# Altium schematic sheet Umb104.SchDoc
size A
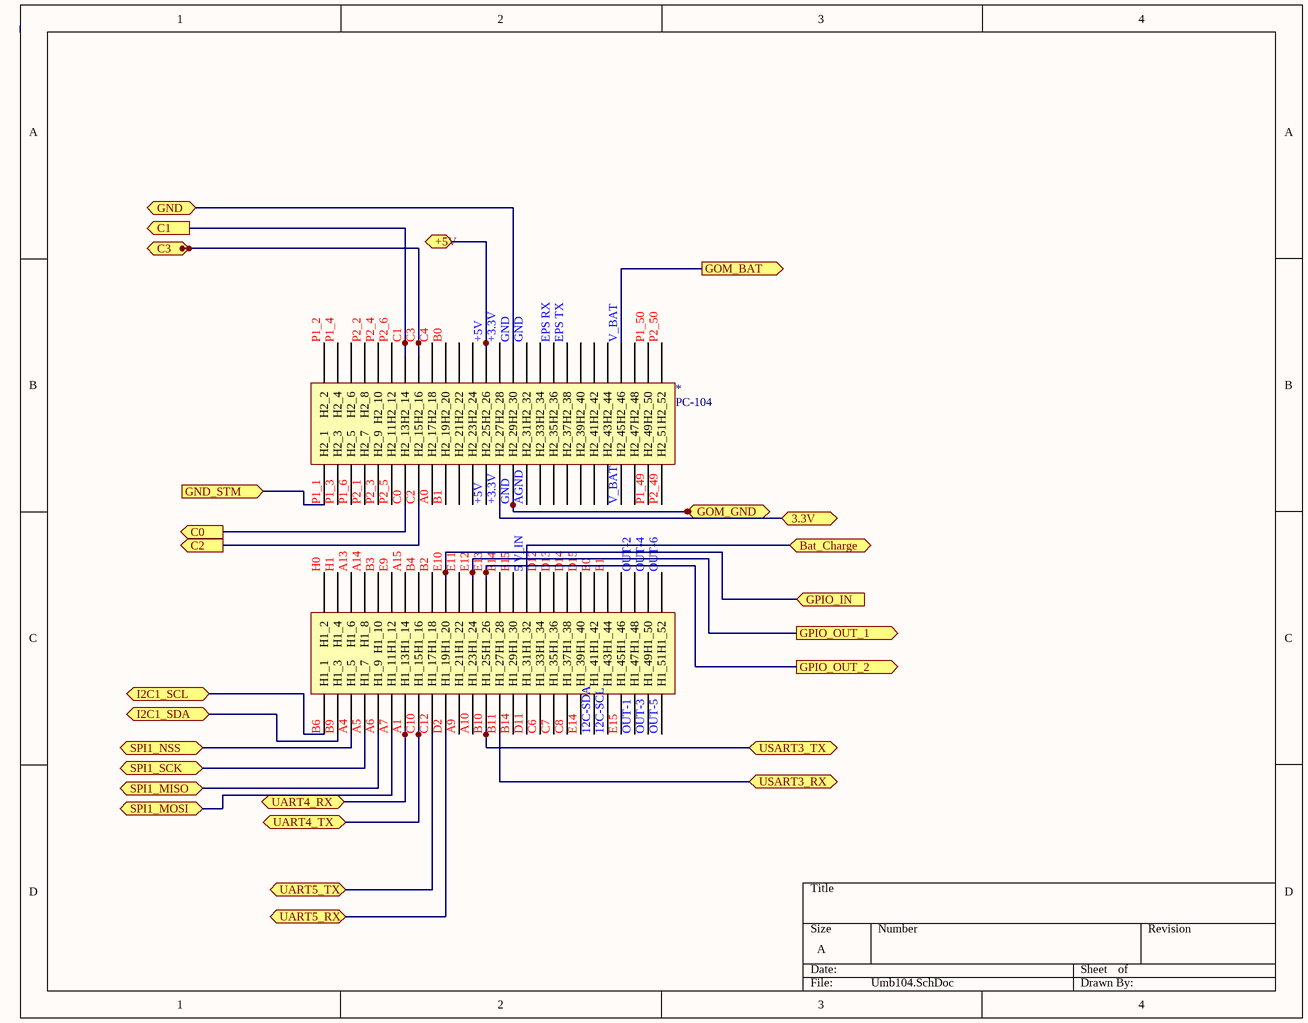
[diagram p0: Umb104.SchDoc]

## Parts
*  PC-104  [PC-104FOOTPRINT]

## Ports
3.3V (bidir), +5V (bidir), Bat_Charge (bidir), C0 (out), C1 (out), C2 (out), C3 (out), GND (bidir), GND_STM (in), GOM_BAT (out), GOM_GND (bidir), GPIO_IN (in), GPIO_OUT_1 (out), GPIO_OUT_2 (out), I2C1_SCL (bidir), I2C1_SDA (bidir), SPI1_MISO (bidir), SPI1_MOSI (bidir), SPI1_NSS (bidir), SPI1_SCK (bidir), UART4_RX (bidir), UART4_TX (bidir), UART5_RX (bidir), UART5_TX (bidir), USART3_RX (bidir), USART3_TX (bidir)

## Nets
5 V_IN: *.H1_32 ; port Bat_Charge
12C-SCL: *.H1_43
12C-SDA: *.H1_41
+3.3V: *.H2_27 *.H2_28 ; port 3.3V
+5V: *.H2_25 *.H2_26 ; port +5V
A0: *.H2_17
A1: *.H1_13 ; port UART4_RX
A4: *.H1_5 ; port SPI1_NSS
A5: *.H1_7 ; port SPI1_SCK
A6: *.H1_9 ; port SPI1_MISO
A7: *.H1_11 ; port SPI1_MOSI
A9: *.H1_21
A10: *.H1_23
A13: *.H1_6
A14: *.H1_8
A15: *.H1_14
AGND: *.H2_31
B0: *.H2_20
B1: *.H2_19
B2: *.H1_18
B3: *.H1_10
B4: *.H1_16
B6: *.H1_1 ; port I2C1_SCL
B9: *.H1_3 ; port I2C1_SDA
B10: *.H1_25 ; port USART3_TX
B11: *.H1_27 ; port USART3_RX
B14: *.H1_29
C0: *.H2_13 ; port C0
C1: *.H2_14 ; port C1
C2: *.H2_15 ; port C2
C3: *.H2_16 ; port C3
C4: *.H2_18
C6: *.H1_33
C7: *.H1_35
C8: *.H1_37
C10: *.H1_15 ; port UART4_TX
C12: *.H1_17 ; port UART5_TX
D2: *.H1_19 ; port UART5_RX
D11: *.H1_31
D12: *.H1_34
D13: *.H1_36
D14: *.H1_38
D15: *.H1_40
E0: *.H1_42
E1: *.H1_44
E9: *.H1_12
E10: *.H1_20 ; port GPIO_IN
E11: *.H1_22
E12: *.H1_24 ; port GPIO_OUT_1
E13: *.H1_26 ; port GPIO_OUT_2
E14: *.H1_28 *.H1_39
E15: *.H1_30 *.H1_45
EPS RX: *.H2_36
EPS TX: *.H2_38
GND: *.H2_29 *.H2_30 *.H2_32 ; port GND, port GOM_GND
H0: *.H1_2
H1: *.H1_4
OUT-1: *.H1_47
OUT-2: *.H1_48
OUT-3: *.H1_49
OUT-4: *.H1_50
OUT-5: *.H1_51
OUT-6: *.H1_52
P1_1: *.H2_1 ; port GND_STM
P1_2: *.H2_2
P1_3: *.H2_3
P1_4: *.H2_4
P1_6: *.H2_5
P1_49: *.H2_49
P1_50: *.H2_50
P2_1: *.H2_7
P2_2: *.H2_8
P2_3: *.H2_9
P2_4: *.H2_10
P2_5: *.H2_11
P2_6: *.H2_12
P2_49: *.H2_51
P2_50: *.H2_52
V_BAT: *.H2_45 *.H2_46 ; port GOM_BAT

Not connected (* = marked no-connect by the designer): * H1_46 H2_6 H2_21 H2_22 H2_23 H2_24 H2_33 H2_34 H2_35 H2_37 H2_39 H2_40 H2_41 H2_42 H2_43 H2_44 H2_47 H2_48